# EAGLE design 2656 (EAGLE 9.4.2)
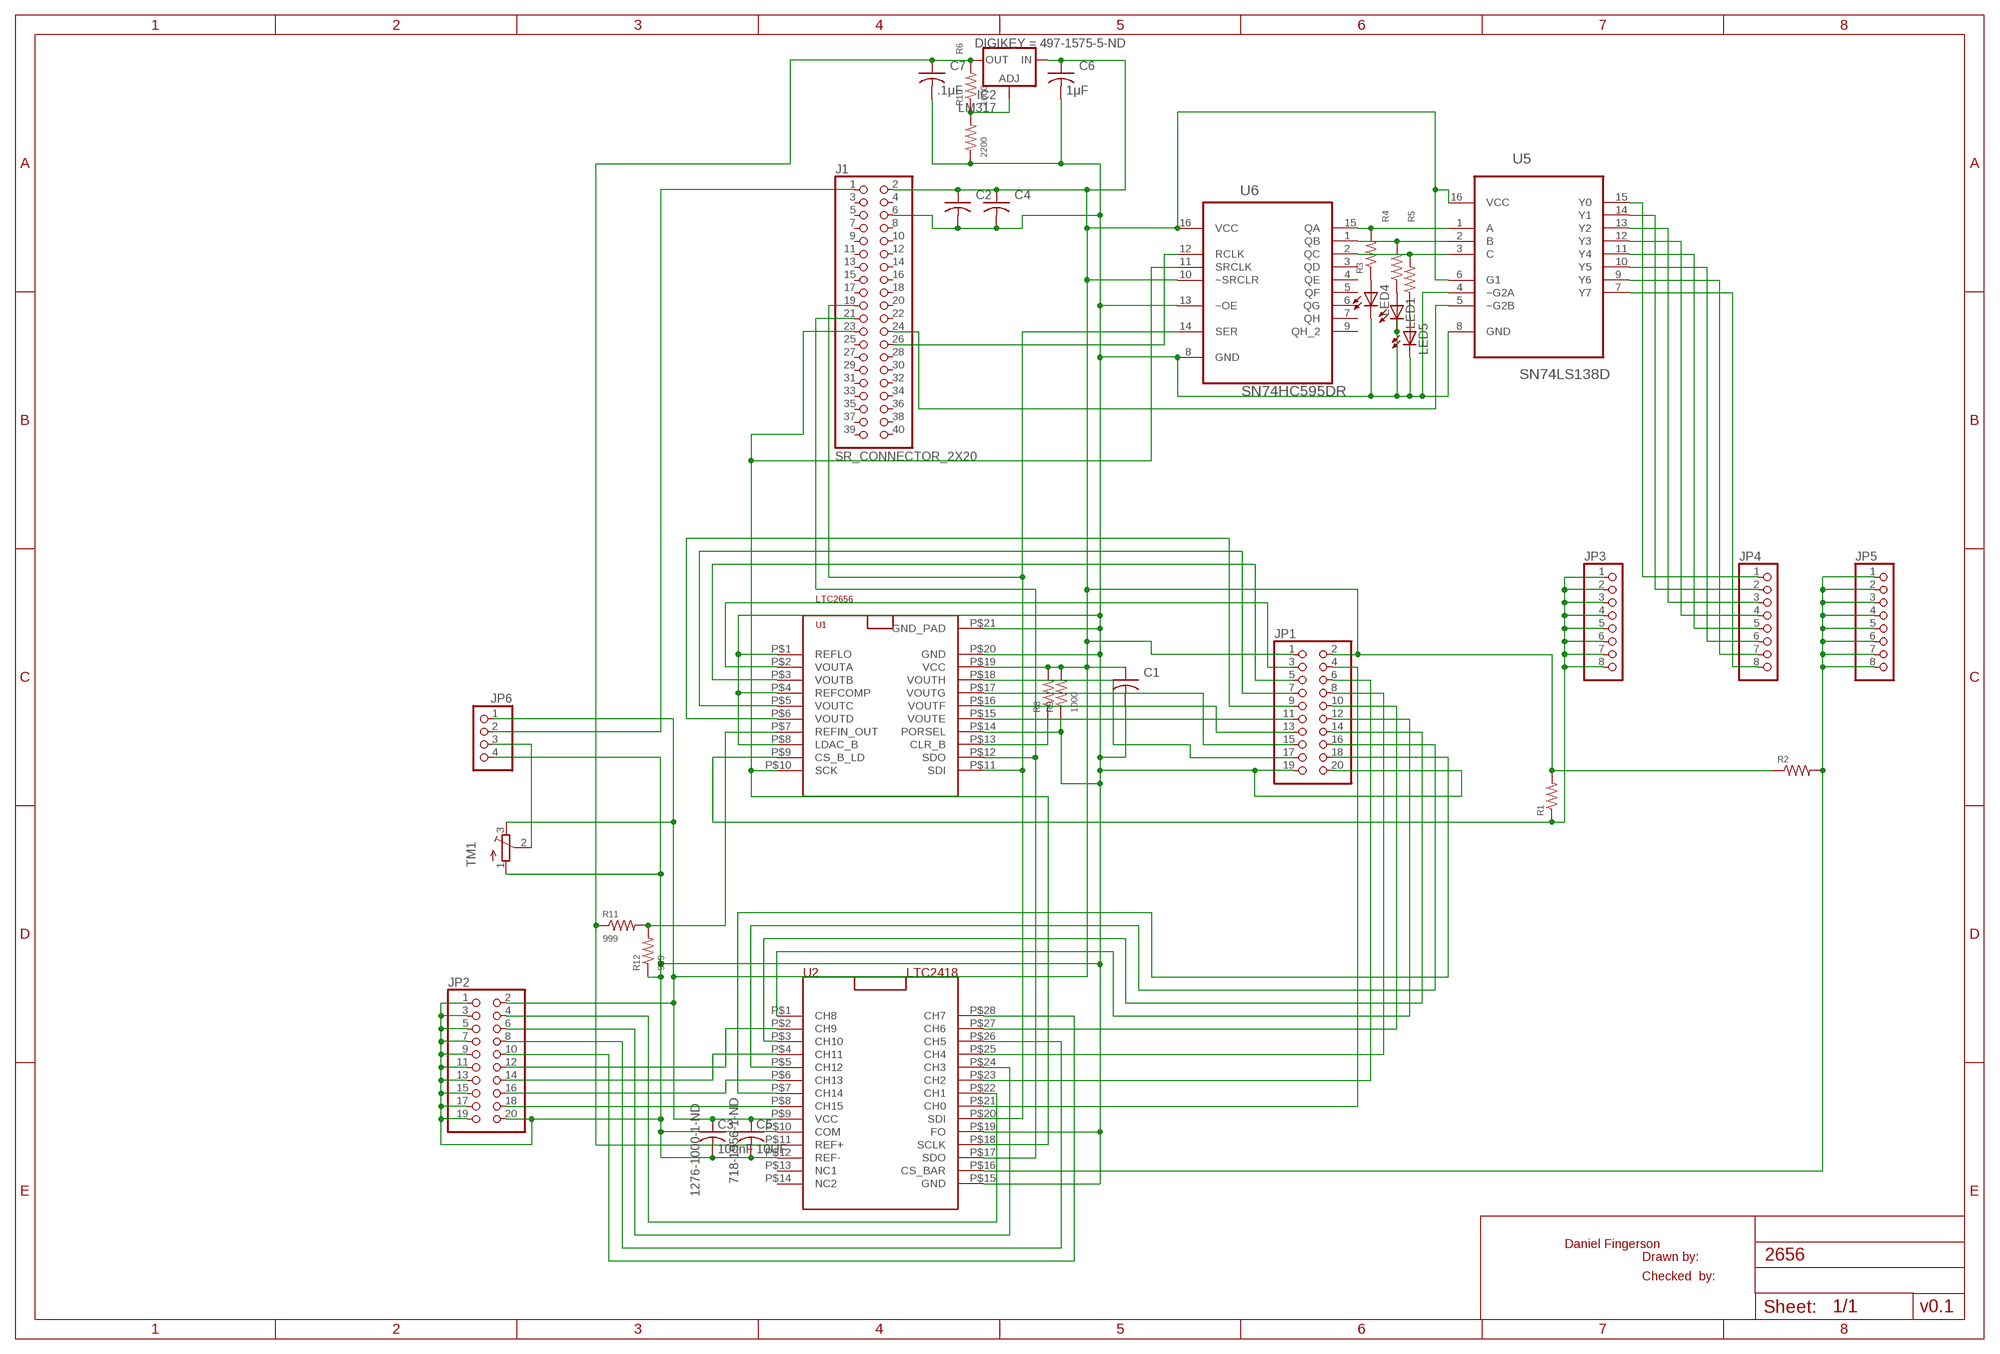
[diagram p0: schematic, sheet 1]

## Parts
C1  C-USC1206  [C1206]
C2  C-USC1206  [C1206]
C3  100nF  C-USC1206  [C1206]
C4  C-USC1206  [C1206]
C5  10UF  C-USC1206  [C1206]
C6  1μF  C-USC1206  [C1206]
C7  .1μF  C-USC1206  [C1206]
IC2  LM317  LM317TL  [317TL]
J1  SR_CONNECTOR_2X20  [SR_CONNECTOR_2X20]
JP1  PINHD-2X10  [2X10]
JP2  PINHD-2X10  [2X10]
JP3  PINHD-1X8BIG  [1X08-BIG]
JP4  PINHD-1X8BIG  [1X08-BIG]
JP5  PINHD-1X8BIG  [1X08-BIG]
JP6  PINHD-1X4  [1X04]
LED1  LEDCHIPLED_1206  [CHIPLED_1206]
LED4  LEDCHIPLED_1206  [CHIPLED_1206]
LED5  LEDCHIPLED_1206  [CHIPLED_1206]
R1  R-US_R1206  [R1206]
R2  R-US_R1206  [R1206]
R3  R-US_R1206  [R1206]
R4  R-US_R1206  [R1206]
R5  R-US_R1206  [R1206]
R6  1000  R-US_R1206  [R1206]
R8  R-US_R1206  [R1206]
R9  1000  R-US_R1206  [R1206]
R10  2200  R-US_R1206  [R1206]
R11  999  R-US_R1206  [R1206]
R12  999  R-US_R1206  [R1206]
TM1  TRIMPOT3386  [TRIM-3386]
U1  LTC2656  [SR_TSSOP20]
U2  LTC2418  [SR_SSOP28]
U5  SN74LS138D  [SOIC127P600X175-16N]
U6  SN74HC595DR  [SOIC127P600X175-16N]

## Nets
N$1: JP1.10 U2.P$27(CH6)
N$3: JP4.1 U5.15(Y0)
N$5: JP1.3 U1.P$2(VOUTA)
N$6: JP1.5 U1.P$3(VOUTB)
N$7: J1.23 U1.P$10(SCK) U2.P$18(SCLK) U6.11(SRCLK)
N$8: LED1.A R4.1
N$9: J1.21 U1.P$12(SDO) U2.P$17(SDO)
N$10: J1.19 U1.P$11(SDI) U2.P$20(SDI) U6.14(SER)
N$11: R8.1 U1.P$13(CLR_B)
N$12: C1.2 C2.2 C3.2 C4.2 C5.2 C6.2 C7.2 J1.6 JP1.19 JP1.20 JP2.1 JP2.3 JP2.5 JP2.7 JP2.9 JP2.11 JP2.13 JP2.15 JP2.17 JP2.19 JP2.20 JP6.4 LED1.C LED4.C LED5.C R9.1 R10.1 R12.1 TM1.1(A) U1.P$1(REFLO) U1.P$4(REFCOMP) U1.P$8(LDAC_B) U1.P$14(PORSEL) U1.P$20(GND) U1.P$21(GND_PAD) U2.P$10(COM) U2.P$12(REF-) U2.P$15(GND) U2.P$19(FO) U5.4(~G2A) U5.8(GND) U6.8(GND) U6.13(~OE)
N$13: JP1.7 U1.P$5(VOUTC)
N$14: JP1.4 U2.P$21(CH0)
N$15: R3.2 U5.1(A) U6.15(QA)
N$16: JP1.9 U1.P$6(VOUTD)
N$17: JP1.11 U1.P$15(VOUTE)
N$18: JP1.13 U1.P$16(VOUTF)
N$19: R4.2 U5.2(B) U6.1(QB)
N$20: R5.2 U5.3(C) U6.2(QC)
N$21: JP1.15 U1.P$17(VOUTG)
N$22: JP1.17 U1.P$18(VOUTH)
N$23: JP1.6 U2.P$23(CH2)
N$24: J1.24 U5.5(~G2B)
N$25: JP1.8 U2.P$25(CH4)
N$26: JP1.18 U2.P$7(CH14)
N$27: J1.26 U6.12(RCLK)
N$28: JP4.2 U5.14(Y1)
N$29: JP1.12 U2.P$1(CH8)
N$30: JP1.14 U2.P$3(CH10)
N$31: JP1.16 U2.P$5(CH12)
N$32: JP2.4 U2.P$22(CH1)
N$33: JP2.6 U2.P$24(CH3)
N$34: JP2.8 U2.P$26(CH5)
N$35: JP2.10 U2.P$28(CH7)
N$36: JP2.18 U2.P$8(CH15)
N$37: JP4.3 U5.13(Y2)
N$38: JP2.12 U2.P$2(CH9)
N$39: JP2.14 U2.P$4(CH11)
N$40: JP2.16 U2.P$6(CH13)
N$41: JP4.4 U5.12(Y3)
N$42: JP4.5 U5.11(Y4)
N$43: JP4.6 U5.10(Y5)
N$44: JP4.7 U5.9(Y6)
N$45: JP4.8 U5.7(Y7)
N$47: JP3.1 JP3.2 JP3.3 JP3.4 JP3.5 JP3.6 JP3.7 JP3.8 R1.1 U1.P$9(CS_B_LD)
N$48: JP5.1 JP5.2 JP5.3 JP5.4 JP5.5 JP5.6 JP5.7 JP5.8 R2.2 U2.P$16(CS_BAR)
N$49: LED4.A R3.1
N$50: LED5.A R5.1
N$51: J1.1 JP6.2
N$52: JP6.3 TM1.2(S)
N$53: C7.1 IC2.2(OUT) R6.2 R11.1 U2.P$11(REF+)
N$54: IC2.1(ADJ) R6.1 R10.2
V+3P3: R11.2 R12.2 U1.P$7(REFIN_OUT)
V+5: C1.1 C2.1 C3.1 C4.1 C5.1 C6.1 IC2.3(IN) J1.2 JP1.1 JP1.2 JP2.2 JP6.1 R1.2 R2.1 R8.2 R9.2 TM1.3(E) U1.P$19(VCC) U2.P$9(VCC) U5.6(G1) U5.16(VCC) U6.10(~SRCLR) U6.16(VCC)
Unconnected: J1.3 J1.4 J1.5 J1.7 J1.8 J1.9 J1.10 J1.11 J1.12 J1.13 J1.14 J1.15 J1.16 J1.17 J1.18 J1.20 J1.22 J1.25 J1.27 J1.28 J1.29 J1.30 J1.31 J1.32 J1.33 J1.34 J1.35 J1.36 J1.37 J1.38 J1.39 J1.40 U2.P$13(NC1) U2.P$14(NC2) U6.3(QD) U6.4(QE) U6.5(QF) U6.6(QG) U6.7(QH) U6.9(QH_2)

## Notes on the sheet
- Daniel Fingerson
- Drawn by:
- Checked  by:
- v0.1

## Library data of the parts
C1 C2 C4 C6 C7 = adafruit:C-US: CAPACITOR, American symbol
C3 = adafruit:C-US: CAPACITOR, American symbol; DIGIKEY: 1276-1000-1-ND
C5 = adafruit:C-US: CAPACITOR, American symbol; DIGIKEY: 718-1956-1-ND
IC2 = v-reg:LM317TL: VOLTAGE REGULATOR; DIGIKEY: 497-1575-5-ND
J1 = SR_general_lbr1:SR_CONNECTOR_2X20: Keyed Connector 2x20 for Raspberry Pi S9175-ND CONN HEADER VERT 40POS 2.54MM; DIGIKEY: S9175-ND
JP1 JP2 = pinhead:PINHD-2X10: PIN HEADER
JP3-JP5 = adafruit:PINHD-1X8: PIN HEADER
JP6 = pinhead:PINHD-1X4: PIN HEADER
LED1 LED4 LED5 = adafruit:LED: LED OSRAM: - CHIPLED LG R971, LG N971, LY N971, LG Q971, LY Q971, LO R971, LY R971 LH N974, LH R974 LS Q976, LO Q976, LY Q976 LO Q996 - Hyper CHIPLED LW Q18S LB Q993, LB Q99A, LB R99A - SideLED LS A670, LO A670, LY A670, LG A670, LP A670 LB A673, LV A673, LT A673, LW A673 LH A674 LY A675 LS A676, LA A676, LO A676, LY A676, LW A676 LS A679, LY A679, LG A679 - Hyper Micro SIDELED® LS Y876, LA Y876, LO Y876, LY Y876 LT Y87S - SmartLED LW L88C, LW L88S LB L89C, LB L89S, LG L890 LS L89K, LO L89K, LY L89K LS L896, LA L896, LO L896, LY L896 - TOPLED LS T670, LO T670, LY T670, LG T670, LP T670 LSG T670, LSP T670, LSY T670, LOP T670, LYG T670 LG T671, LOG T671, LSG T671 LB T673, LV T673, LT T673, LW T673 LH T674 LS T676, LA T676, LO T676, LY T676, LB T676, LH T676, LSB T676, LW T676 LB T67C, LV T67C, LT T67C, LS T67K, LO T67K, LY T67K, LW E67C LS E67B, LA E67B, LO E67B, LY E67B, LB E67C, LV E67C, LT E67C LW T67C LS T679, LY T679, LG T679 LS T770, LO T770, LY T770, LG T770, LP T770 LB T773, LV T773, LT T773, LW T773 LH T774 LS E675, LA E675, LY E675, LS T675 LS T776, LA T776, LO T776, LY T776, LB T776 LHGB T686 LT T68C, LB T68C - Hyper Mini TOPLED® LB M676 - Mini TOPLED Santana® LG M470 LS M47K, LO M47K, LY M47K Source: http://www.osram.convergy.de/
R1-R6 R8-R12 = adafruit:R-US_: RESISTOR, American symbol
TM1 = adafruit:TRIMPOT: SMT trimmer potentiometer part number TC33X http://www.ladyada.net/library/eagle
U1 = SR_general_lbr_home:LTC2656: DAC LT2656 DIGIKEY part LTC2656IFE-L12#PBF-ND; DIGIKEY: LTC2656IFE-L12#PBF-ND
U2 = SR_general_lbr_home:LTC2418: LTC2418 16chan 24bit ADC LTC2418CGN#PBF-ND https://www.analog.com/media/en/technical-documentation/data-sheets/241418fb.pdf; DIGIKEY: LTC2418CGN#PBF-ND
U5 = Texas Instruments_By_element14_Batch_1:SN74LS138D: 3-LINE TO 8-LINE DECODERS /DEMULTIPLEXERXS; MPN: SN74LS138D; OC_FARNELL: 9592288; OC_NEWARK: 67K2854; PACKAGE: SOIC-16; SUPPLIER: TEXAS INSTRUMENTS
U6 = Texas Instruments_By_element14_Batch_1:SN74HC595DR: 8-BIT SHIFT REGISTERS WITH 3-STATE OUTPUT REGISTERS; MPN: SN74HC595DR; OC_FARNELL: 1607849; OC_NEWARK: 67K2850; PACKAGE: SOIC-16; SPICEPREFIX: X; SUPPLIER: TEXAS INSTRUMENTS

## Board
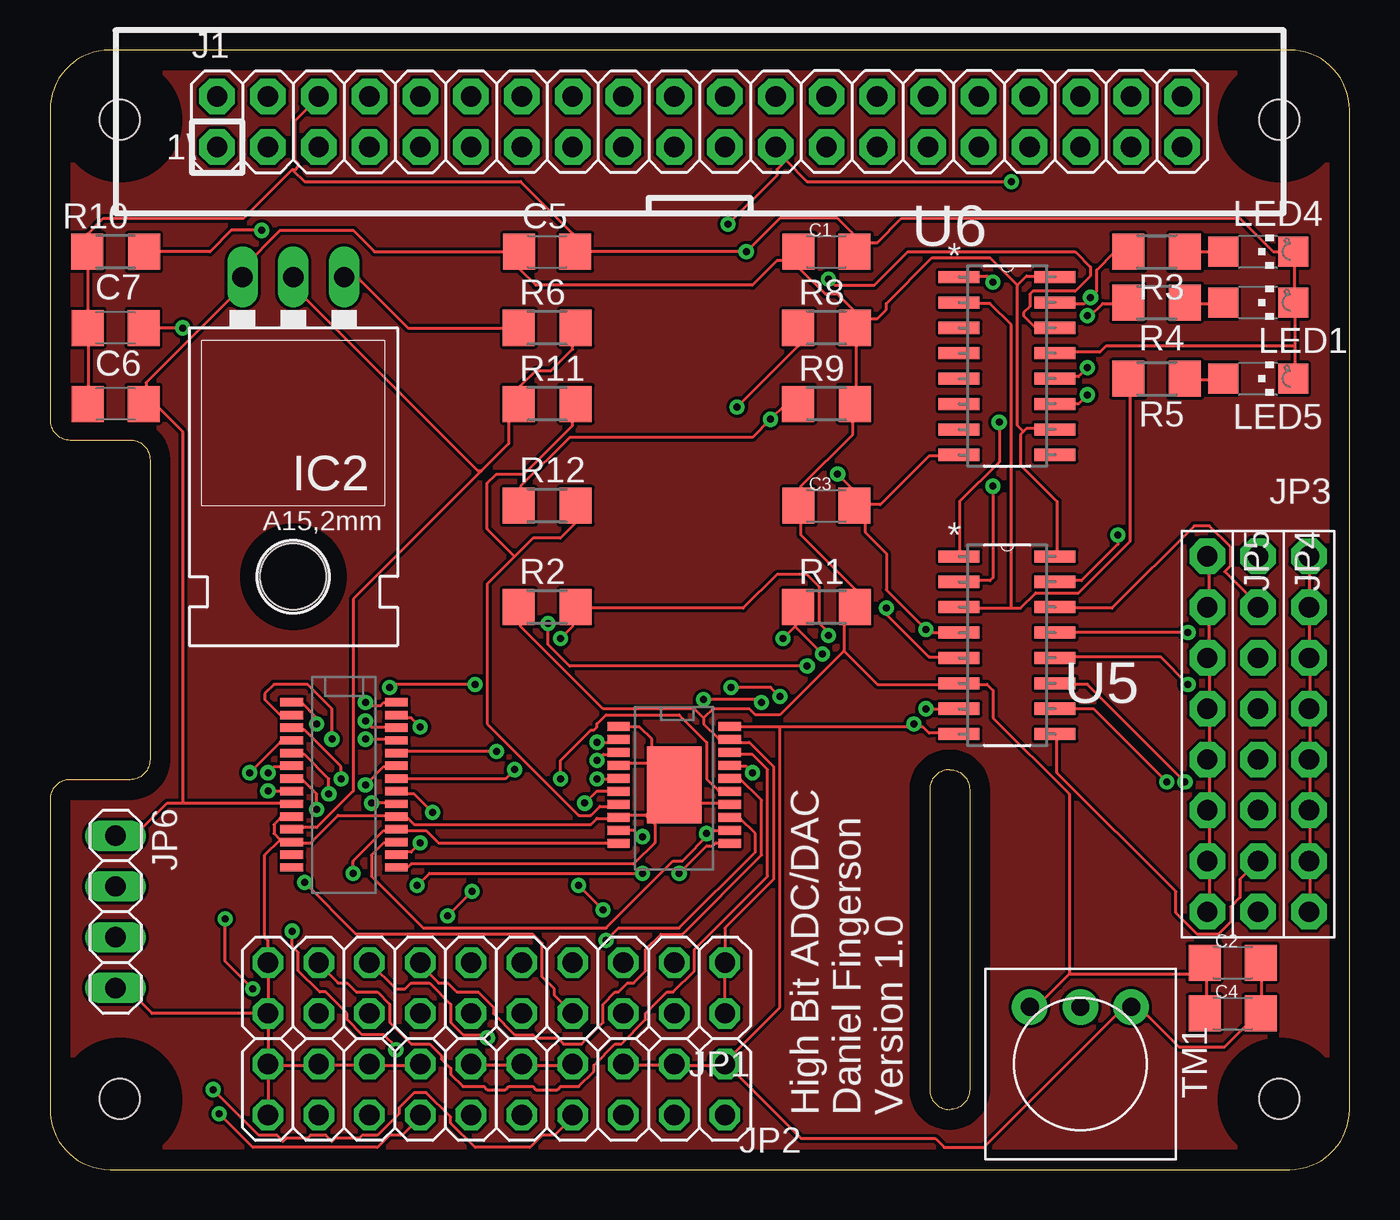
[diagram p1: board, top side]
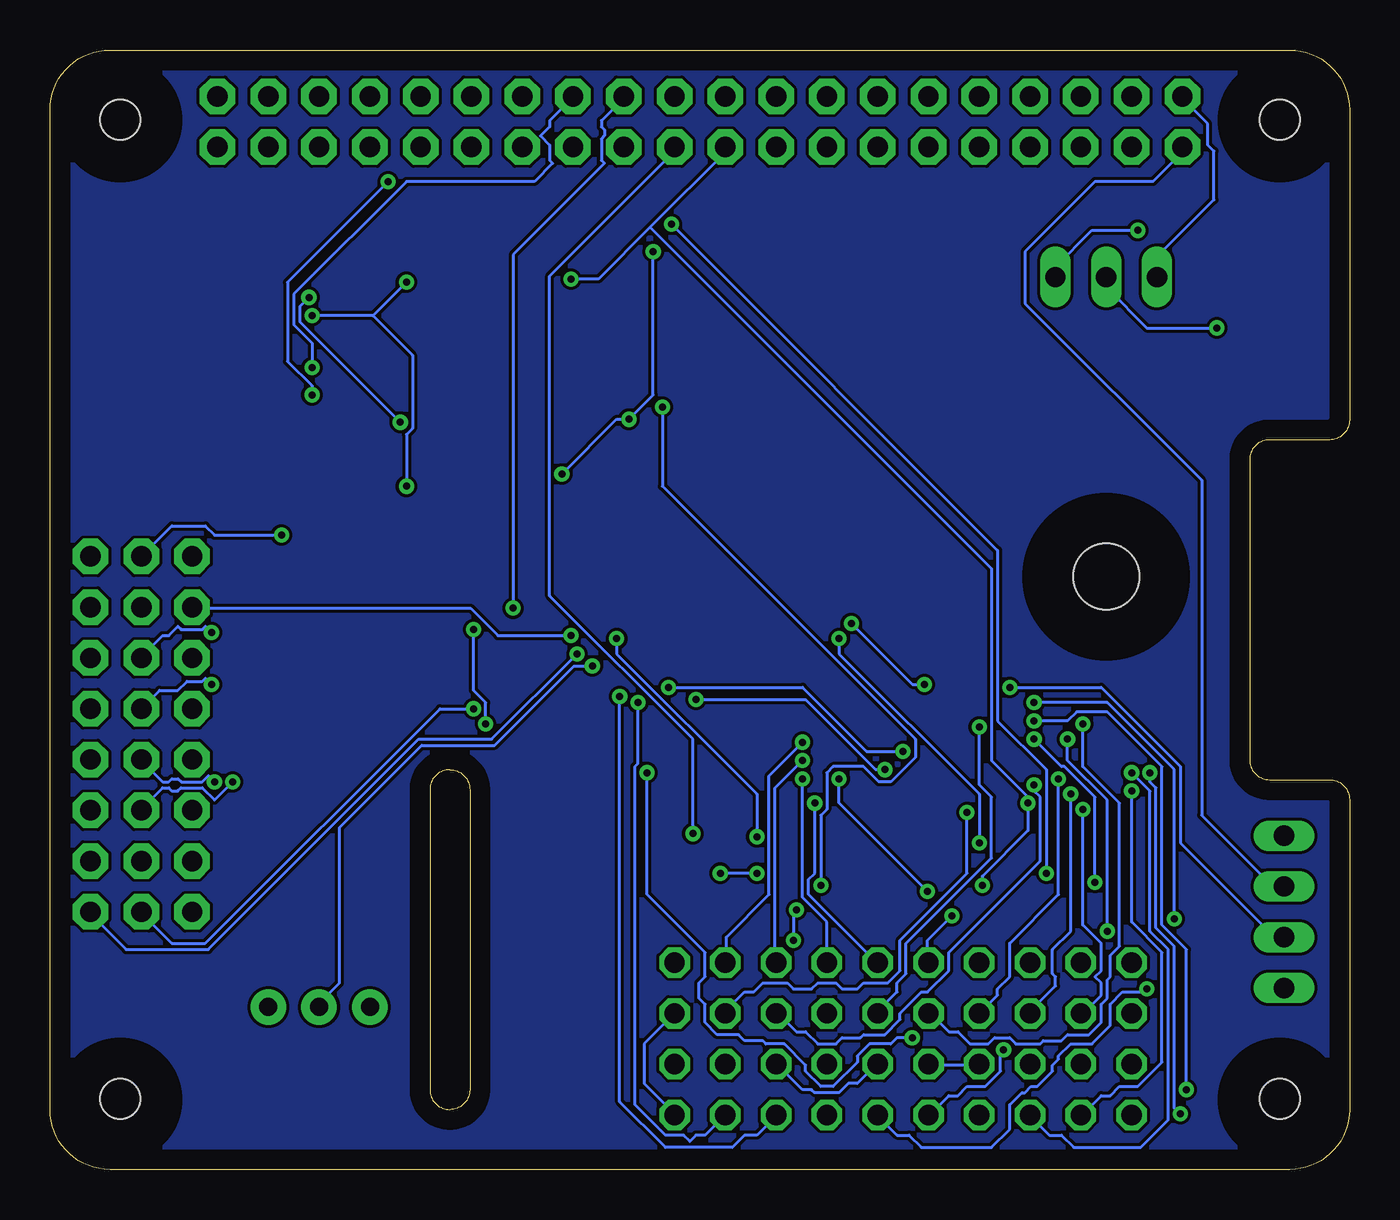
[diagram p2: board, bottom side, seen from below]

Size 65 x 56 mm. Coordinates in mm from the lower left corner, seen from the top.
Outline: 0,3 arc90 3,0 62,0 arc90 65,3 65,53 arc90 62,56 3,56 arc90 0,53 0,37.5 arc90 1,36.5 4,36.5 arc-90 5,35.5 5,20.5 arc-90 4,19.5 1,19.5 arc90 0,18.5 0,3
Outline: 44,19 44,4 arc90 45,3 arc90 46,4 46,19 arc90 45,20 arc90 44,19
Copper layers (1*16): Top 0.035mm / dielectric 1.5mm / Bottom 0.035mm
Design rules "default": minimum track width 6mil, minimum drill 0.35mm, track to track 6mil, track to pad 6mil, pad to pad 6mil, via to via 6mil, smd to smd 6mil, copper to edge 40mil, drill to drill 6mil, minimum pad ring 10mil, minimum via ring 8mil, stop-mask expansion 4mil, vias tented up to drill 0mil, thermal gap 10mil
Holes 2 mm at 3.48,52.51 3.48,3.54 61.5,3.54 61.5,52.51
tRestrict: area 2,51 to 5,54; area 60,51 to 63,54; area 60,1.9 to 63,5.1; area 2,1.9 to 5,5.1
bRestrict: area 2,1.9 to 5,5.1; area 2,51 to 5,54; area 60,1.9 to 63,5.1; area 60,51 to 63,54

### Footprints (pad centres in the part's own frame; a part is rotated, then mirrored left to right if it is on the bottom)
C1206 = smd 1.6 x 1.8: 1 -1.4,0; 2 1.4,0
317TL = drill 1.016 long: 1 -2.54,-3.81; 2 0,-3.81; 3 2.54,-3.81 | hole 3.302: 0,11.176
SR_CONNECTOR_2X20 = drill 1.016 pad 1.778 octagon: 1 -26.67,-1.27; 2 -26.67,1.27; 3 -24.13,-1.27; 4 -24.13,1.27; 5 -21.59,-1.27; 6 -21.59,1.27; 7 -19.05,-1.27; 8 -19.05,1.27; 9 -16.51,-1.27; 10 -16.51,1.27; 11 -13.97,-1.27; 12 -13.97,1.27; 13 -11.43,-1.27; 14 -11.43,1.27; 15 -8.89,-1.27; 16 -8.89,1.27; 17 -6.35,-1.27; 18 -6.35,1.27; 19 -3.81,-1.27; 20 -3.81,1.27; 21 -1.27,-1.27; 22 -1.27,1.27; 23 1.27,-1.27; 24 1.27,1.27; 25 3.81,-1.27; 26 3.81,1.27; 27 6.35,-1.27; 28 6.35,1.27; 29 8.89,-1.27; 30 8.89,1.27; 31 11.43,-1.27; 32 11.43,1.27; 33 13.97,-1.27; 34 13.97,1.27; 35 16.51,-1.27; 36 16.51,1.27; 37 19.05,-1.27; 38 19.05,1.27; 39 21.59,-1.27; 40 21.59,1.27
2X10 = drill 1.016 octagon: 1 -11.43,-1.27; 2 -11.43,1.27; 3 -8.89,-1.27; 4 -8.89,1.27; 5 -6.35,-1.27; 6 -6.35,1.27; 7 -3.81,-1.27; 8 -3.81,1.27; 9 -1.27,-1.27; 10 -1.27,1.27; 11 1.27,-1.27; 12 1.27,1.27; 13 3.81,-1.27; 14 3.81,1.27; 15 6.35,-1.27; 16 6.35,1.27; 17 8.89,-1.27; 18 8.89,1.27; 19 11.43,-1.27; 20 11.43,1.27
1X08-BIG = drill 1.016 pad 1.778 octagon: 1 -8.89,0; 2 -6.35,0; 3 -3.81,0; 4 -1.27,0; 5 1.27,0; 6 3.81,0; 7 6.35,0; 8 8.89,0
1X04 = drill 1.016 long: 1 -3.81,0; 2 -1.27,0; 3 1.27,0; 4 3.81,0
CHIPLED_1206 = smd 1.5 x 1.5: A 0,-1.75; C 0,1.75
R1206 = smd 1.6 x 1.803: 1 -1.422,0; 2 1.422,0
TRIM-3386 = drill 0.9 pad 1.778: 1 -2.54,-2.857; 2 0,-2.857; 3 2.54,-2.857
SR_TSSOP20 = smd 0.43 x 1.1: P$1 -2.925,-2.78; P$2 -2.275,-2.78; P$3 -1.625,-2.78; P$4 -0.975,-2.78; P$5 -0.325,-2.78; P$6 0.325,-2.78; P$7 0.975,-2.78; P$8 1.625,-2.78; P$9 2.275,-2.78; P$10 2.925,-2.78; P$11 2.925,2.78; P$12 2.275,2.78; P$13 1.625,2.78; P$14 0.975,2.78; P$15 0.325,2.78; P$16 -0.325,2.78; P$17 -0.975,2.78; P$18 -1.625,2.78; P$19 -2.275,2.78; P$20 -2.925,2.78 | smd 3.86 x 2.74: P$21 0,0
SR_SSOP28 = smd 0.419 x 1.143: P$1 -4.128,-2.616; P$2 -3.493,-2.616; P$3 -2.857,-2.616; P$4 -2.223,-2.616; P$5 -1.587,-2.616; P$6 -0.953,-2.616; P$7 -0.318,-2.616; P$8 0.318,-2.616; P$9 0.953,-2.616; P$10 1.587,-2.616; P$11 2.223,-2.616; P$12 2.857,-2.616; P$13 3.493,-2.616; P$14 4.128,-2.616; P$15 4.128,2.616; P$16 3.493,2.616; P$17 2.857,2.616; P$18 2.223,2.616; P$19 1.587,2.616; P$20 0.953,2.616; P$21 0.318,2.616; P$22 -0.318,2.616; P$23 -0.953,2.616; P$24 -1.587,2.616; P$25 -2.223,2.616; P$26 -2.857,2.616; P$27 -3.493,2.616; P$28 -4.128,2.616
SOIC127P600X175-16N = smd 2.057 x 0.61: 1 -4.801,8.89; 2 -4.801,7.62; 3 -4.801,6.35; 4 -4.801,5.08; 5 -4.801,3.81; 6 -4.801,2.54; 7 -4.801,1.27; 8 -4.801,0; 9 0,0; 10 0,1.27; 11 0,2.54; 12 0,3.81; 13 0,5.08; 14 0,6.35; 15 0,7.62; 16 0,8.89

### Placement (x,y rotation side)
C1  38.84,45.91 0 top
C2  59.16,10.35 0 top
C3  38.84,33.21 0 top
C4  59.16,7.81 0 top
C5  24.87,45.91 0 top
C6  3.28,38.29 180 top
C7  3.28,42.1 180 top
IC2  12.17,40.83 180 top
J1  35.03,52.41 0 top
JP1  22.33,9.08 180 top
JP2  22.33,4 180 top
JP3  62.97,21.78 270 top
JP4  60.43,21.78 270 top
JP5  57.89,21.78 270 top
JP6  3.28,12.89 270 top
LED1  60.43,43.37 270 top
LED4  60.43,45.91 270 top
LED5  60.43,39.56 270 top
R1  38.84,28.13 0 top
R2  24.87,28.13 0 top
R3  55.35,45.91 180 top
R4  55.35,43.37 180 top
R5  55.35,39.56 180 top
R6  24.87,42.1 0 top
R8  38.84,42.1 0 top
R9  38.84,38.29 0 top
R10  3.28,45.91 0 top
R11  24.87,38.29 0 top
R12  24.87,33.21 0 top
TM1  51.54,5.27 180 top
U1  31.22,19.24 270 top
U2  14.71,19.24 270 top
U5  50.27,21.78 0 top
U6  50.27,35.75 0 top

### Tracks (layer width: path | path; a pad name or v marks a point on that pad's centre or on a via)
GND1
  pour Bottom: 0,3 arc90 3,0 62,0 arc90 65,3 65,53 arc90 62,56 3,56 arc90 0,53 0,37.5 arc90 1,36.5 4,36.5 arc-90 5,35.5 5,20.5 arc-90 4,19.5 1,19.5 arc90 0,18.5
  pour Top: 0,3 arc90 3,0 62,0 arc90 65,3 65,53 arc90 62,56 3,56 arc90 0,53 0,37.5 arc90 1,36.5 4,36.5 arc-90 5,35.5 5,20.5 arc-90 4,19.5 1,19.5 arc90 0,18.5
N$1  (via drill 0.35)
  Top 0.152: v18.52,22.14 18.06,22.59 17.45,22.59 U2.P$27
  Bottom 0.152: v18.52,22.14 18.52,19.24 17.91,18.63 17.91,15.58 22.18,11.32 22.18,9.79 22.63,9.33 22.63,8.88 23.7,7.81 JP1.10
N$3  (via drill 0.35)
  Top 0.152: v53.42,31.74 53.42,31.28 51.59,29.45 50.37,29.45 U5.15
  Bottom 0.152: v53.42,31.74 56.77,31.74 57.23,32.19 58.91,32.19 JP4.1
N$5  (via drill 0.35)
  Top 0.152: v27.36,21.37 28.43,21.37 U1.P$2
  Bottom 0.152: v27.36,21.37 29.04,19.7 29.04,13.75 31.17,11.62 31.17,10.4 JP1.3
N$6  (via drill 0.35)
  Top 0.152: v27.36,20.46 27.66,20.76 28.43,20.76 U1.P$3
  Bottom 0.152: v27.36,20.46 28.73,19.09 28.73,10.4 JP1.5
N$7  (via drill 0.35)
  Top 0.152: U1.P$10 28.43,16.34 19.43,16.34 18.82,16.95 17.45,16.95 U2.P$18 17.3,16.95 16.69,16.95 15.17,15.43 v15.17,14.82 | U6.11 51.44,38.29 v51.9,38.75 | v48.09,49.41 37.88,49.41 36.81,50.48 | 36.81,50.48 J1.23 36.35,50.94 | v33.91,47.28 36.35,49.72 36.35,50.02 36.81,50.48
  Bottom 0.152: v51.9,38.75 51.9,39.2 53.12,40.42 53.12,44.39 v48.09,49.41 | v15.17,14.82 15.17,20 17.61,22.44 17.61,30.98 v33.91,47.28
N$8
  Top 0.152: LED1.A 58.6,43.32 56.77,43.32 R4.1
N$9  (via drill 0.35)
  Top 0.152: 33,16.8 31.63,15.43 31.17,15.43 27.82,12.08 18.67,12.08 16.08,14.67 16.08,15.73 16.69,16.34 17.3,16.34 U2.P$17 | 33,16.8 33.15,16.95 33.91,16.95 U1.P$12 | 33,16.8 v32.85,16.8
  Bottom 0.152: v32.85,16.8 32.85,21.53 40.01,28.69 40.01,44.69 33.76,50.94 J1.21
N$10  (via drill 0.35)
  Top 0.152: v31.47,14.82 32.85,16.19 33.15,16.19 33.3,16.34 33.91,16.34 U1.P$11 | v29.64,14.82 18.98,14.82 v18.37,14.21 | v16.08,18.33 17.3,18.33 U2.P$20 | U6.14 49.3,42.1 48.7,42.71 48.7,42.86 49,43.17 49,43.78 49.15,43.93 51.29,43.93 52.05,44.69 52.05,45.15 51.29,45.91 42.9,45.91 41.23,44.23 39.25,44.23 v38.94,44.54
  Bottom 0.152: v29.64,14.82 v31.47,14.82 | v18.37,14.21 18.37,14.67 16.08,16.95 v16.08,18.33 16.08,18.63 17.91,20.46 17.91,30.06 34.98,47.13 | v38.94,44.54 37.57,44.54 34.98,47.13 | 34.98,47.13 31.17,50.94 J1.19
N$11  (via drill 0.35)
  Top 0.152: v27.82,11.47 28.43,12.08 31.47,12.08 35.28,15.89 35.28,16.8 34.52,17.56 34.06,17.56 U1.P$13 | v26.45,14.21 v27.66,12.99 | v34.37,38.14 37.42,41.19 R8.1 | R8.1
  Bottom 0.152: v27.82,11.47 27.82,12.84 v27.66,12.99 | v26.45,14.21 26.45,17.72 26.14,18.02 26.14,19.85 25.83,20.15 24.31,20.15 23.55,19.39 22.94,19.39 21.72,20.61 21.72,21.53 34.37,34.17 v34.37,38.14
N$12  (via drill 0.35)
  Top 0.152: 62.26,41.19 62.26,43.32 LED1.C 62.26,43.47 62.26,45.91 LED4.C 61.19,45.91 59.52,47.59 42.6,47.59 41.38,46.37 40.16,46.37 | 62.26,41.19 62.26,39.66 LED5.C | 62.26,41.19 52.81,41.19 52.5,40.88 50.37,40.88 U6.13 | 40.16,46.37 40.16,45.91 C1.2 40.16,46.37 | 40.16,46.37 40.16,46.82 39.4,47.59 36.5,47.59 v34.83,45.91 C5.2 26.14,45.91 26.14,46.82 23.55,49.41 12.73,49.41 12.12,50.02 | 1.91,42.1 1.91,38.29 C6.2 | 1.91,42.1 1.91,45.91 | 1.91,42.1 C7.2 | 12.12,50.02 12.27,50.02 12.42,50.18 12.42,50.33 12.27,50.48 12.27,52.46 13.34,53.53 J1.6 | 12.12,50.02 9.68,47.59 2.67,47.59 1.91,46.82 1.91,45.91 | 1.91,45.91 R10.1 | 29.8,17.72 28.58,17.72 U1.P$8 28.43,17.56 27.36,17.56 27.05,17.26 18.21,17.26 17.91,17.56 17.45,17.56 U2.P$19 17.3,17.72 14.41,17.72 13.03,16.34 12.12,16.34 U2.P$12 11.97,16.5 11.51,16.5 | 31.32,19.24 29.8,17.72 | 30.1,20.31 28.58,20.31 U1.P$4 | 30.1,20.31 31.17,19.24 U1.P$21 | 30.1,20.31 30.1,21.53 29.49,22.14 28.58,22.14 U1.P$1 | 30.1,20.31 U1.P$21 | 31.32,19.24 32.24,18.33 33.91,18.33 U1.P$14 | 31.32,19.24 U1.P$21 | 29.8,17.72 30.25,17.26 30.25,16.34 29.19,15.28 18.06,15.28 17.91,15.12 17.45,15.12 U2.P$15 | R9.1 36.81,38.29 v36.05,37.53 35.13,36.61 25.99,36.61 23.55,34.17 23.55,33.26 R12.1 | 40.77,33.26 41.53,33.26 43.97,35.7 45.34,35.7 U6.8 | 40.77,33.26 40.31,33.26 C3.2 | U5.4 43.97,26.86 v43.82,27.01 41.84,28.99 41.84,30.82 40.77,31.89 40.77,33.26 | 40.77,33.26 C3.2 | 43.21,22.14 43.67,22.14 43.97,21.83 45.34,21.83 U5.8 | 43.21,22.14 36.5,22.14 | 36.5,22.14 34.06,22.14 U1.P$20 | C2.2 60.58,10.25 60.58,7.81 C4.2 60.43,7.81 58.75,6.13 56.47,6.13 54.49,8.12 54.18,8.12 TM1.1 54.03,8.12 53.72,8.12 46.71,1.1 44.73,1.1 44.28,1.56 37.57,1.56 33.76,5.37
  Top 0.152: JP2.5 28.73,5.22 31.17,5.22 JP2.3 31.32,5.22 33.76,5.22 JP2.1 33.76,5.37 | JP2.11 21.11,5.22 23.55,5.22 JP2.9 23.7,5.22 26.14,5.22 JP2.7 | JP2.13 18.52,5.22 16.08,5.22 JP2.15 15.93,5.22 13.49,5.22 JP2.17 13.34,5.22 10.9,5.22 | 10.9,5.22 JP2.20 | 11.51,16.5 11.21,16.8 11.21,17.26 11.51,17.56 11.97,17.56 U2.P$10 | JP1.20 JP1.19 10.9,11.47 10.75,11.62 10.75,15.73 11.51,16.5 | JP1.20 5.11,7.81 3.89,9.03 3.28,9.03 JP6.4 | JP1.20 JP2.19 10.9,5.22 | 36.5,22.14 36.5,8.12 33.76,5.37 | 43.21,22.14 v43.21,22.29 | v39.4,34.79 40.16,34.02 40.16,33.26 C3.2
  Bottom 0.152: JP2.11 20.96,5.22 18.52,5.22 JP2.13 | JP2.5 28.58,5.22 27.36,4 26.9,4 26.75,3.85 25.53,3.85 25.07,4.3 24.62,4.3 23.7,5.22 JP2.9 | v43.82,27.01 43.82,23.96 43.21,23.36 v43.21,22.29 | v39.4,34.79 36.66,37.53 v36.05,37.53 34.83,38.75 v34.83,45.91
N$13  (via drill 0.35)
  Top 0.152: v27.36,19.55 28.43,19.55 U1.P$5
  Bottom 0.152: v27.36,19.55 27.36,13.6 26.14,12.38 JP1.7
N$14  (via drill 0.35)
  Top 0.152: v19.13,17.87 18.21,18.78 17.45,18.78 U2.P$21
  Bottom 0.152: v19.13,17.87 19.13,14.82 22.48,11.47 22.48,9.94 23.09,9.33 24.31,9.33 24.62,9.03 25.38,9.03 25.68,9.33 26.6,9.33 26.9,9.03 27.82,9.03 28.12,9.33 29.34,9.33 29.8,8.88 30.25,8.88 31.32,7.81 JP1.4
N$15  (via drill 0.35)
  Top 0.152: R3.2 53.27,45.91 52.35,45 52.35,43.93 v52.05,43.62 51.74,43.32 50.37,43.32 U6.15 | v47.48,37.38 47.48,35.39 45.49,33.41 45.49,30.67 U5.1
  Bottom 0.152: v47.48,37.38 52.5,42.41 52.5,43.17 v52.05,43.62
N$16  (via drill 0.35)
  Top 0.152: v26.75,18.33 27.36,18.93 28.43,18.93 U1.P$6
  Bottom 0.152: v26.75,18.33 26.75,14.82 27.05,14.52 27.05,13.75 23.7,10.4 JP1.9
N$17  (via drill 0.35)
  Top 0.152: v25.53,19.55 25.53,20.46 27.05,21.98 27.21,21.98 27.36,22.14 27.36,22.29 27.82,22.75 31.47,22.75 32.85,21.37 32.85,19.55 33.45,18.93 33.91,18.93 U1.P$15 | v19.89,12.69 v21.11,13.91
  Bottom 0.152: v25.53,19.55 25.53,18.33 v21.11,13.91 | v19.89,12.69 21.11,11.47 21.11,10.4 JP1.11
N$18
  Top 0.152: U1.P$16 34.06,19.55 34.52,19.55 35.59,18.48 35.59,15.73 31.63,11.77 30.56,11.77 29.8,11.01 29.8,9.94 29.19,9.33 28.88,9.33 28.43,8.88 28.27,8.88 27.66,8.27 27.66,7.35 26.6,6.29 25.68,6.29 25.38,6.59 24.31,6.59 24.16,6.74 23.24,6.74 22.18,7.81 22.18,8.12 21.42,8.88 20.35,8.88 19.89,9.33 19.43,9.33 18.52,10.25 JP1.13
N$19  (via drill 0.35)
  Top 0.152: v51.9,42.71 52.05,42.71 52.66,43.32 53.88,43.32 R4.2 | v47.17,44.39 46.87,44.69 45.49,44.69 U6.1 | v47.17,34.17 47.17,29.6 47.02,29.45 45.49,29.45 U5.2
  Bottom 0.152: 48.85,42.71 v51.9,42.71 | v47.17,44.39 48.85,42.71 | v47.17,34.17 47.17,36.77 46.87,37.07 46.87,40.73 48.85,42.71
N$20
  Top 0.152: 48.09,28.08 45.49,28.08 U5.3 | 48.09,28.08 48.54,28.08 49.3,28.84 51.44,28.84 54.03,31.43 54.03,39.51 R5.2 | 48.09,28.08 48.09,42.25 47.02,43.32 45.49,43.32 U6.2
N$21  (via drill 0.35)
  Top 0.152: v35.13,19.85 34.83,20.15 34.06,20.15 U1.P$17 | v21.87,6.59 21.72,6.74 20.65,6.74 20.04,7.35 20.04,8.27 18.98,9.33 18.06,9.33 17.76,9.03 17.3,9.03 JP1.15
  Bottom 0.152: v35.13,19.85 35.13,13.75 32.24,10.86 32.24,9.64 32.54,9.33 32.54,8.57 32.24,8.27 32.24,7.35 31.63,6.74 30.56,6.74 30.25,6.44 29.34,6.44 29.19,6.29 28.27,6.29 27.21,5.22 27.21,4.91 26.45,4.15 25.83,4.15 24.62,5.37 24.62,5.68 24.01,6.29 22.94,6.29 22.63,6.59 v21.87,6.59
N$22
  Top 0.152: U1.P$18 34.06,20.76 35.13,20.76 35.89,20 35.89,14.67 32.24,11.01 32.24,9.94 31.17,8.88 30.86,8.88 29.8,7.81 29.8,7.51 28.58,6.29 28.27,6.29 27.21,5.22 27.21,4.91 26.45,4.15 25.53,4.15 25.38,4 24.31,4 24.16,4.15 22.94,4.15 22.79,4 21.87,4 21.72,4.15 20.65,4.15 20.04,4.76 20.04,5.07 19.59,5.52 19.59,5.68 18.98,6.29 18.06,6.29 17,7.35 17,8.27 16.39,8.88 15.32,8.88 14.86,9.33 14.41,9.33 13.49,10.25 JP1.17
N$23  (via drill 0.35)
  Top 0.152: v15.78,19.24 16.69,20.15 17.3,20.15 U2.P$23
  Bottom 0.152: v15.78,19.24 15.78,18.93 15.47,18.63 15.47,15.43 20.04,10.86 20.04,9.94 21.11,8.88 21.42,8.88 22.48,7.81 22.48,7.51 23.24,6.74 24.31,6.74 24.46,6.59 25.38,6.59 25.68,6.29 26.6,6.29 27.21,6.9 27.66,6.9 28.58,7.81 JP1.6
N$24  (via drill 0.35)
  Top 0.152: v41.84,28.08 41.84,27.77 43.97,25.64 45.34,25.64 U5.5
  Bottom 0.152: v41.84,28.08 41.84,45.76 37.27,50.33 37.42,50.48 37.42,51.55 37.27,51.7 37.27,52.01 37.42,52.16 37.42,52.46 36.35,53.53 J1.24
N$25  (via drill 0.35)
  Top 0.152: v15.78,21.53 17.3,21.53 U2.P$25 | v12.73,14.36 15.32,11.77 24.16,11.77 24.62,11.32 24.62,9.64 25.23,9.03 25.23,8.72 JP1.8
  Bottom 0.152: v15.78,21.53 14.41,20.15 14.25,20.15 12.73,18.63 v12.73,14.36
N$26  (via drill 0.35)
  Top 0.152: v13.34,18.02 13.34,18.78 12.58,19.55 12.12,19.55 U2.P$7
  Bottom 0.152: v13.34,18.02 13.34,12.23 12.42,11.32 12.42,9.94 12.73,9.64 12.42,9.33 12.42,8.72 13.34,7.81 JP1.18
N$27  (via drill 0.35)
  Top 0.152: v51.9,40.12 51.44,39.66 50.37,39.66 U6.12
  Bottom 0.152: v51.9,40.12 51.9,41.34 52.81,42.25 52.81,43.78 47.17,49.41 40.77,49.41 39.86,50.33 40.01,50.48 40.01,51.24 40.47,51.7 40.01,52.16 40.01,52.46 38.94,53.53 J1.26
N$28
  Top 0.152: U5.14 50.37,28.08 53.12,28.08 57.23,32.19 57.99,32.19 59.06,31.13 59.06,30.21 58.75,29.91 60.43,28.23 JP4.2
N$29  (via drill 0.35)
  Top 0.152: v13.34,22.29 13.34,22.59 12.58,23.36 12.12,23.36 U2.P$1
  Bottom 0.152: v13.34,22.29 13.34,20.15 11.51,18.33 11.51,11.16 11.97,10.71 11.97,9.64 12.12,9.49 12.12,8.57 12.42,8.27 12.42,7.35 13.03,6.74 14.1,6.74 14.41,6.44 15.32,6.44 15.47,6.29 16.69,6.29 17,6.59 17.76,6.59 18.06,6.29 18.98,6.29 19.59,6.9 20.04,6.9 20.96,7.81 JP1.12
N$30  (via drill 0.35)
  Top 0.152: v14.56,19.55 14.56,20.15 12.73,21.98 12.12,21.98 U2.P$3
  Bottom 0.152: v14.56,19.55 14.56,13.75 17,11.32 17,9.64 17.61,9.03 17.61,8.72 JP1.14
N$31  (via drill 0.35)
  Top 0.152: v13.95,18.78 13.95,19.55 12.73,20.76 12.12,20.76 U2.P$5
  Bottom 0.152: v13.95,18.78 13.95,11.93 14.86,11.01 14.86,9.79 14.71,9.64 14.71,9.18 16.08,7.81 JP1.16
N$32  (via drill 0.35)
  Top 0.152: v23.24,20 22.79,19.55 17.45,19.55 U2.P$22 | v32.69,23.51 35.44,23.51 v35.59,23.36
  Bottom 0.152: v23.24,20 23.7,20 27.21,23.51 v32.69,23.51 | v35.59,23.36 35.59,20.31 35.74,20.15 35.74,3.24 34.22,1.71 33.3,1.71 33,1.41 32.69,1.71 32.24,1.71 JP2.4
N$33  (via drill 0.35)
  Top 0.152: v22.33,20.92 17.45,20.92 U2.P$24 | v34.06,24.12 36.05,24.12 v36.5,23.66
  Bottom 0.152: v22.33,20.92 24.16,20.92 27.36,24.12 v34.06,24.12 | v36.5,23.66 36.5,3.39 34.22,1.1 30.86,1.1 30.25,1.71 29.64,1.71 28.73,2.63 JP2.6
N$34  (via drill 0.35)
  Top 0.152: v15.78,22.44 16.08,22.14 17.3,22.14 U2.P$26 | v8.16,4 10.44,1.71 11.36,1.71 11.66,1.41 11.81,1.56 12.88,1.56 13.03,1.71 13.8,1.71 14.1,1.41 14.25,1.56 15.47,1.56 15.62,1.71 16.39,1.71 17.45,2.78 17.45,3.09 18.21,3.85 18.82,3.85 20.04,2.63 20.04,2.32 21.26,1.1 24.01,1.1 24.62,1.71 25.23,1.71 26.14,2.63 JP2.8
  Bottom 0.152: v15.78,22.44 14.1,22.44 13.64,22.9 12.12,22.9 9.38,20.15 9.38,12.23 8.16,11.01 v8.16,4
N$35  (via drill 0.35)
  Top 0.152: v15.78,23.36 15.93,23.2 16.54,23.2 16.69,23.36 17.3,23.36 U2.P$28 | v8.77,12.53 8.77,10.4 v10.14,9.03
  Bottom 0.152: v15.78,23.36 12.12,23.36 8.77,20 v8.77,12.53 | v10.14,9.03 10.29,8.88 11.36,8.88 11.97,8.27 11.97,7.2 12.88,6.29 13.95,6.29 14.56,5.68 14.56,5.52 14.86,5.22 14.86,4.91 15.62,4.15 15.93,4.15 16.23,3.85 16.39,3.85 17,3.24 17,2.02 17.91,1.1 21.42,1.1 22.02,1.71 22.63,1.71 23.55,2.63 JP2.10
N$36  (via drill 0.35)
  Top 0.152: v10.9,18.93 11.97,18.93 U2.P$8
  Bottom 0.152: v10.9,18.93 10.9,12.38 9.38,10.86 9.38,5.37 10.6,4.15 11.51,4.15 11.97,3.7 12.42,3.7 13.34,2.78 JP2.18
N$37  (via drill 0.35)
  Top 0.152: v56.92,26.86 U5.13
  Bottom 0.152: v56.92,26.86 57.23,27.16 57.38,27.01 58.45,27.01 58.6,27.16 59.06,26.71 59.36,26.71 60.43,25.64 JP4.3
N$38  (via drill 0.35)
  Top 0.152: v14.1,21.53 14.1,23.05 12.88,24.27 11.21,24.27 10.75,23.81 10.75,23.51 11.51,22.75 11.97,22.75 U2.P$2 | v12.12,11.93 12.12,11.16 12.42,10.86 12.42,9.94 13.49,8.88 13.8,8.88 14.86,7.81 14.86,7.51 15.62,6.74 16.69,6.74 17.3,6.13 v17.3,5.98
  Bottom 0.152: v14.1,21.53 14.1,20.46 12.12,18.48 v12.12,11.93 | v17.3,5.98 17.45,5.83 17.45,4.91 18.21,4.15 19.13,4.15 19.59,3.7 20.04,3.7 20.96,2.78 JP2.12
N$39  (via drill 0.35)
  Top 0.152: v9.99,19.85 11.51,21.37 11.97,21.37 U2.P$4 | v8.46,2.78 10.14,1.1 16.39,1.1 17,1.71 17.61,1.71 18.52,2.63 JP2.14
  Bottom 0.152: v9.99,19.85 9.99,19.39 9.68,19.09 9.68,12.08 8.77,11.16 8.77,3.09 v8.46,2.78
N$40  (via drill 0.35)
  Top 0.152: v10.9,19.85 11.21,20.15 11.97,20.15 U2.P$6
  Bottom 0.152: v10.9,19.85 9.99,18.93 9.99,11.93 9.07,11.01 9.07,2.48 10.44,1.1 13.8,1.1 14.41,1.71 15.02,1.71 15.93,2.63 JP2.16
N$41  (via drill 0.35)
  Top 0.152: v56.92,24.27 55.55,25.64 50.37,25.64 U5.12
  Bottom 0.152: v56.92,24.27 57.23,24.57 57.38,24.42 58.14,24.42 58.6,23.96 59.52,23.96 JP4.4
N$42  (via drill 0.35)
  Top 0.152: v56.77,19.39 51.9,24.27 50.37,24.27 U5.11
  Bottom 0.152: v56.77,19.39 57.08,19.7 57.38,19.39 58.45,19.39 58.6,19.55 58.91,19.55 59.06,19.39 59.36,19.39 60.43,20.46 JP4.5
N$43  (via drill 0.35)
  Top 0.152: U5.10 52.2,23.05 v55.86,19.39
  Bottom 0.152: v55.86,19.39 56.77,18.48 57.38,19.09 58.45,19.09 58.6,18.93 58.91,18.93 59.06,19.09 59.36,19.09 60.43,18.02 JP4.6
N$44
  Top 0.152: JP4.7 59.52,14.52 59.52,13.6 59.06,13.14 59.06,12.38 58.45,11.77 57.38,11.77 56.31,12.84 56.31,13.91 50.37,19.85 50.37,21.68 U5.9
N$45  (via drill 0.35)
  Top 0.152: v43.82,23.05 U5.7
  Bottom 0.152: v43.82,23.05 45.49,23.05 57.23,11.32 58.91,11.32 60.43,12.84 JP4.8
N$47  (via drill 0.35)
  Top 0.152: v29.64,16.65 29.49,16.65 29.19,16.95 28.58,16.95 U1.P$9 | 37.27,27.16 37.42,27.32 37.42,28.08 R1.1 | 37.27,27.16 v36.66,26.55 | 63.02,15.43 63.02,12.99 JP3.8 | 63.02,15.43 63.02,17.87 JP3.6 63.02,18.02 63.02,20.46 JP3.5 63.02,20.61 63.02,23.05 | 63.02,15.43 JP3.7 | 63.02,23.05 63.02,25.49 JP3.3 63.02,25.64 63.02,28.08 JP3.2 63.02,28.23 63.02,30.67 JP3.1 | 63.02,23.05 JP3.4 | v38.64,25.79 37.27,27.16
  Bottom 0.152: v29.64,16.65 29.64,18.78 36.66,25.79 v36.66,26.55 | v38.64,25.79 42.9,21.53 46.56,21.53 57.08,11.01 61.19,11.01 63.02,12.84 JP3.8
N$48  (via drill 0.35)
  Top 0.152: v18.52,16.34 18.06,15.89 17.45,15.89 U2.P$16 | v25.53,26.55 26.14,27.16 26.14,28.08 R2.2 26.29,28.08 34.67,28.08 36.35,29.76 37.88,29.76 38.48,29.15 38.48,27.32 38.79,27.01 38.79,26.86 v38.94,26.71 | 57.99,15.43 57.99,12.99 JP5.8 | 57.99,15.43 57.99,17.87 JP5.6 57.99,18.02 57.99,20.46 JP5.5 57.99,20.61 57.99,23.05 | 57.99,15.43 JP5.7 | 57.99,23.05 57.99,25.49 JP5.3 57.99,25.64 57.99,28.08 JP5.2 57.99,28.23 57.99,30.67 JP5.1 | 57.99,23.05 JP5.4
  Bottom 0.152: v18.52,16.34 18.52,18.78 25.53,25.79 v25.53,26.55 | v38.94,26.71 42.6,26.71 43.97,28.08 57.84,28.08 JP5.2
N$49
  Top 0.152: R3.1 LED4.A
N$50
  Top 0.152: LED5.A 58.6,39.51 56.77,39.51 R5.1
N$51
  Bottom 0.152: JP6.2 3.28,14.21 3.89,14.21 7.39,17.72 7.39,34.48 16.23,43.32 16.23,45.91 12.73,49.41 9.83,49.41 8.31,50.94 J1.1
N$52  (via drill 0.35)
  Top 0.152: v17,24.12 17.15,24.27 v21.26,24.27 | v24.92,27.32 24.92,26.25 25.99,25.18 v37.88,25.18
  Bottom 0.152: JP6.3 3.74,11.62 8.46,16.34 8.46,20.15 12.42,24.12 v17,24.12 | v21.26,24.27 21.87,24.27 v24.92,27.32 | v37.88,25.18 38.79,25.18 42.75,21.22 46.41,21.22 50.52,17.11 50.52,9.33 51.59,8.27 TM1.2
N$53  (via drill 0.35)
  Top 0.152: v6.63,42.1 C7.1 | 21.57,34.94 22.94,36.31 22.94,37.83 23.4,38.29 R11.1 23.55,38.29 23.55,39.2 24.31,39.97 25.07,39.97 26.14,41.03 26.14,42.1 R6.2 | 21.57,34.94 15.17,28.54 15.17,18.93 13.34,17.11 12.12,17.11 U2.P$11 | 21.57,34.94 21.42,34.94 12.27,44.08 12.27,44.54 IC2.2
  Bottom 0.152: v6.63,42.1 10.14,42.1 12.12,44.08 12.12,44.54 IC2.2
N$54  (via drill 0.35)
  Top 0.152: R10.2 8,45.91 9.07,46.98 v10.6,46.98 | R6.1 17.91,42.1 15.47,44.54 14.71,44.54 IC2.1
  Bottom 0.152: v10.6,46.98 12.88,46.98 14.71,45.15 IC2.1
V+3P3
  Top 0.152: 23.24,30.67 24.16,31.58 25.53,31.58 26.29,32.35 26.29,33.11 R12.2 | 23.24,30.67 21.87,29.3 21.87,22.29 26.45,17.72 27.05,17.72 27.51,18.17 28.43,18.17 U1.P$7 | 23.24,30.67 21.87,32.04 21.87,34.33 22.33,34.79 23.7,34.79 26.14,37.22 26.14,38.29 R11.2
V+5
  Top 0.152: 6.63,18.33 5.87,18.33 4.35,16.8 3.28,16.8 JP6.1 | 6.63,18.33 11.97,18.33 U2.P$9 | 4.8,38.29 4.8,39.36 9.53,44.08 9.53,44.54 IC2.3 9.68,44.69 9.68,45.15 11.51,46.98 15.17,46.98 16.23,45.91 C5.1 23.55,45.91 23.55,45 24.31,44.23 35.13,44.23 36.35,45.45 37.57,45.45 | 6.63,18.33 6.63,36.92 5.26,38.29 4.8,38.29 | 4.8,38.29 C6.1 | 48.7,36.92 48.85,37.07 50.22,37.07 U6.10 | 48.7,36.92 48.54,36.77 48.54,35.24 50.37,33.41 50.37,30.67 U5.16 | 48.39,44.23 48.85,44.69 50.22,44.69 U6.16 | 48.39,44.23 48.39,37.22 48.7,36.92 | 57.84,9.79 57.84,10.25 C2.1 57.84,9.79 | 57.84,9.79 57.84,7.81 C4.1 | 50.98,9.79 57.84,9.79 | 50.98,9.79 49.46,8.27 49,8.27 TM1.3 | JP1.2 JP1.1 33.76,12.08 36.2,14.52 36.2,20.15 34.98,21.37 34.06,21.37 U1.P$19 33.91,21.53 33.45,21.53 32.69,22.29 32.69,22.59 | 37.57,45.45 37.57,45 38.79,43.78 39.4,43.78 40.16,43.01 40.16,42.56 | 37.57,45.45 37.57,45.91 C1.1 37.57,45.45 | 40.16,42.56 40.16,42.1 R8.2 | R8.2 40.31,42.1 40.31,38.29 R9.2 40.16,38.29 40.16,36.77 37.57,34.17 37.57,33.26 C3.1 37.57,33.11 37.57,31.74 40.31,28.99 40.31,28.23 R1.2 40.16,28.08 39.7,27.62 39.7,25.95 | 32.69,22.59 33.15,23.05 34.98,23.05 35.28,22.75 36.5,22.75 39.7,25.95 | 32.69,22.59 32.24,23.05 27.66,23.05 23.55,27.16 23.55,28.08 R2.1 | 39.7,25.95 41.38,24.27 45.34,24.27 U5.6 45.49,24.27 46.87,24.27 47.17,23.96 47.17,22.59 50.98,18.78 50.98,9.79 | 48.39,44.23 47.02,45.6 44.12,45.6 41.84,43.32 41.84,43.01 41.38,42.56 40.16,42.56 | 40.16,42.56 R8.2
  Bottom 0.152: J1.2 8.31,53.53 7.09,52.31 7.09,51.24 6.79,50.94 6.79,48.5 9.53,45.76 9.53,44.69 IC2.3 | JP1.2 35.28,6.29 35.28,4.3 33.76,2.78 JP2.2

### Text on the board
tPlace: High Bit ADC/DAC / Daniel Fingerson / Version 1.0